# EAGLE design eEvo v1.7_MP8770 (EAGLE 9.6.2)
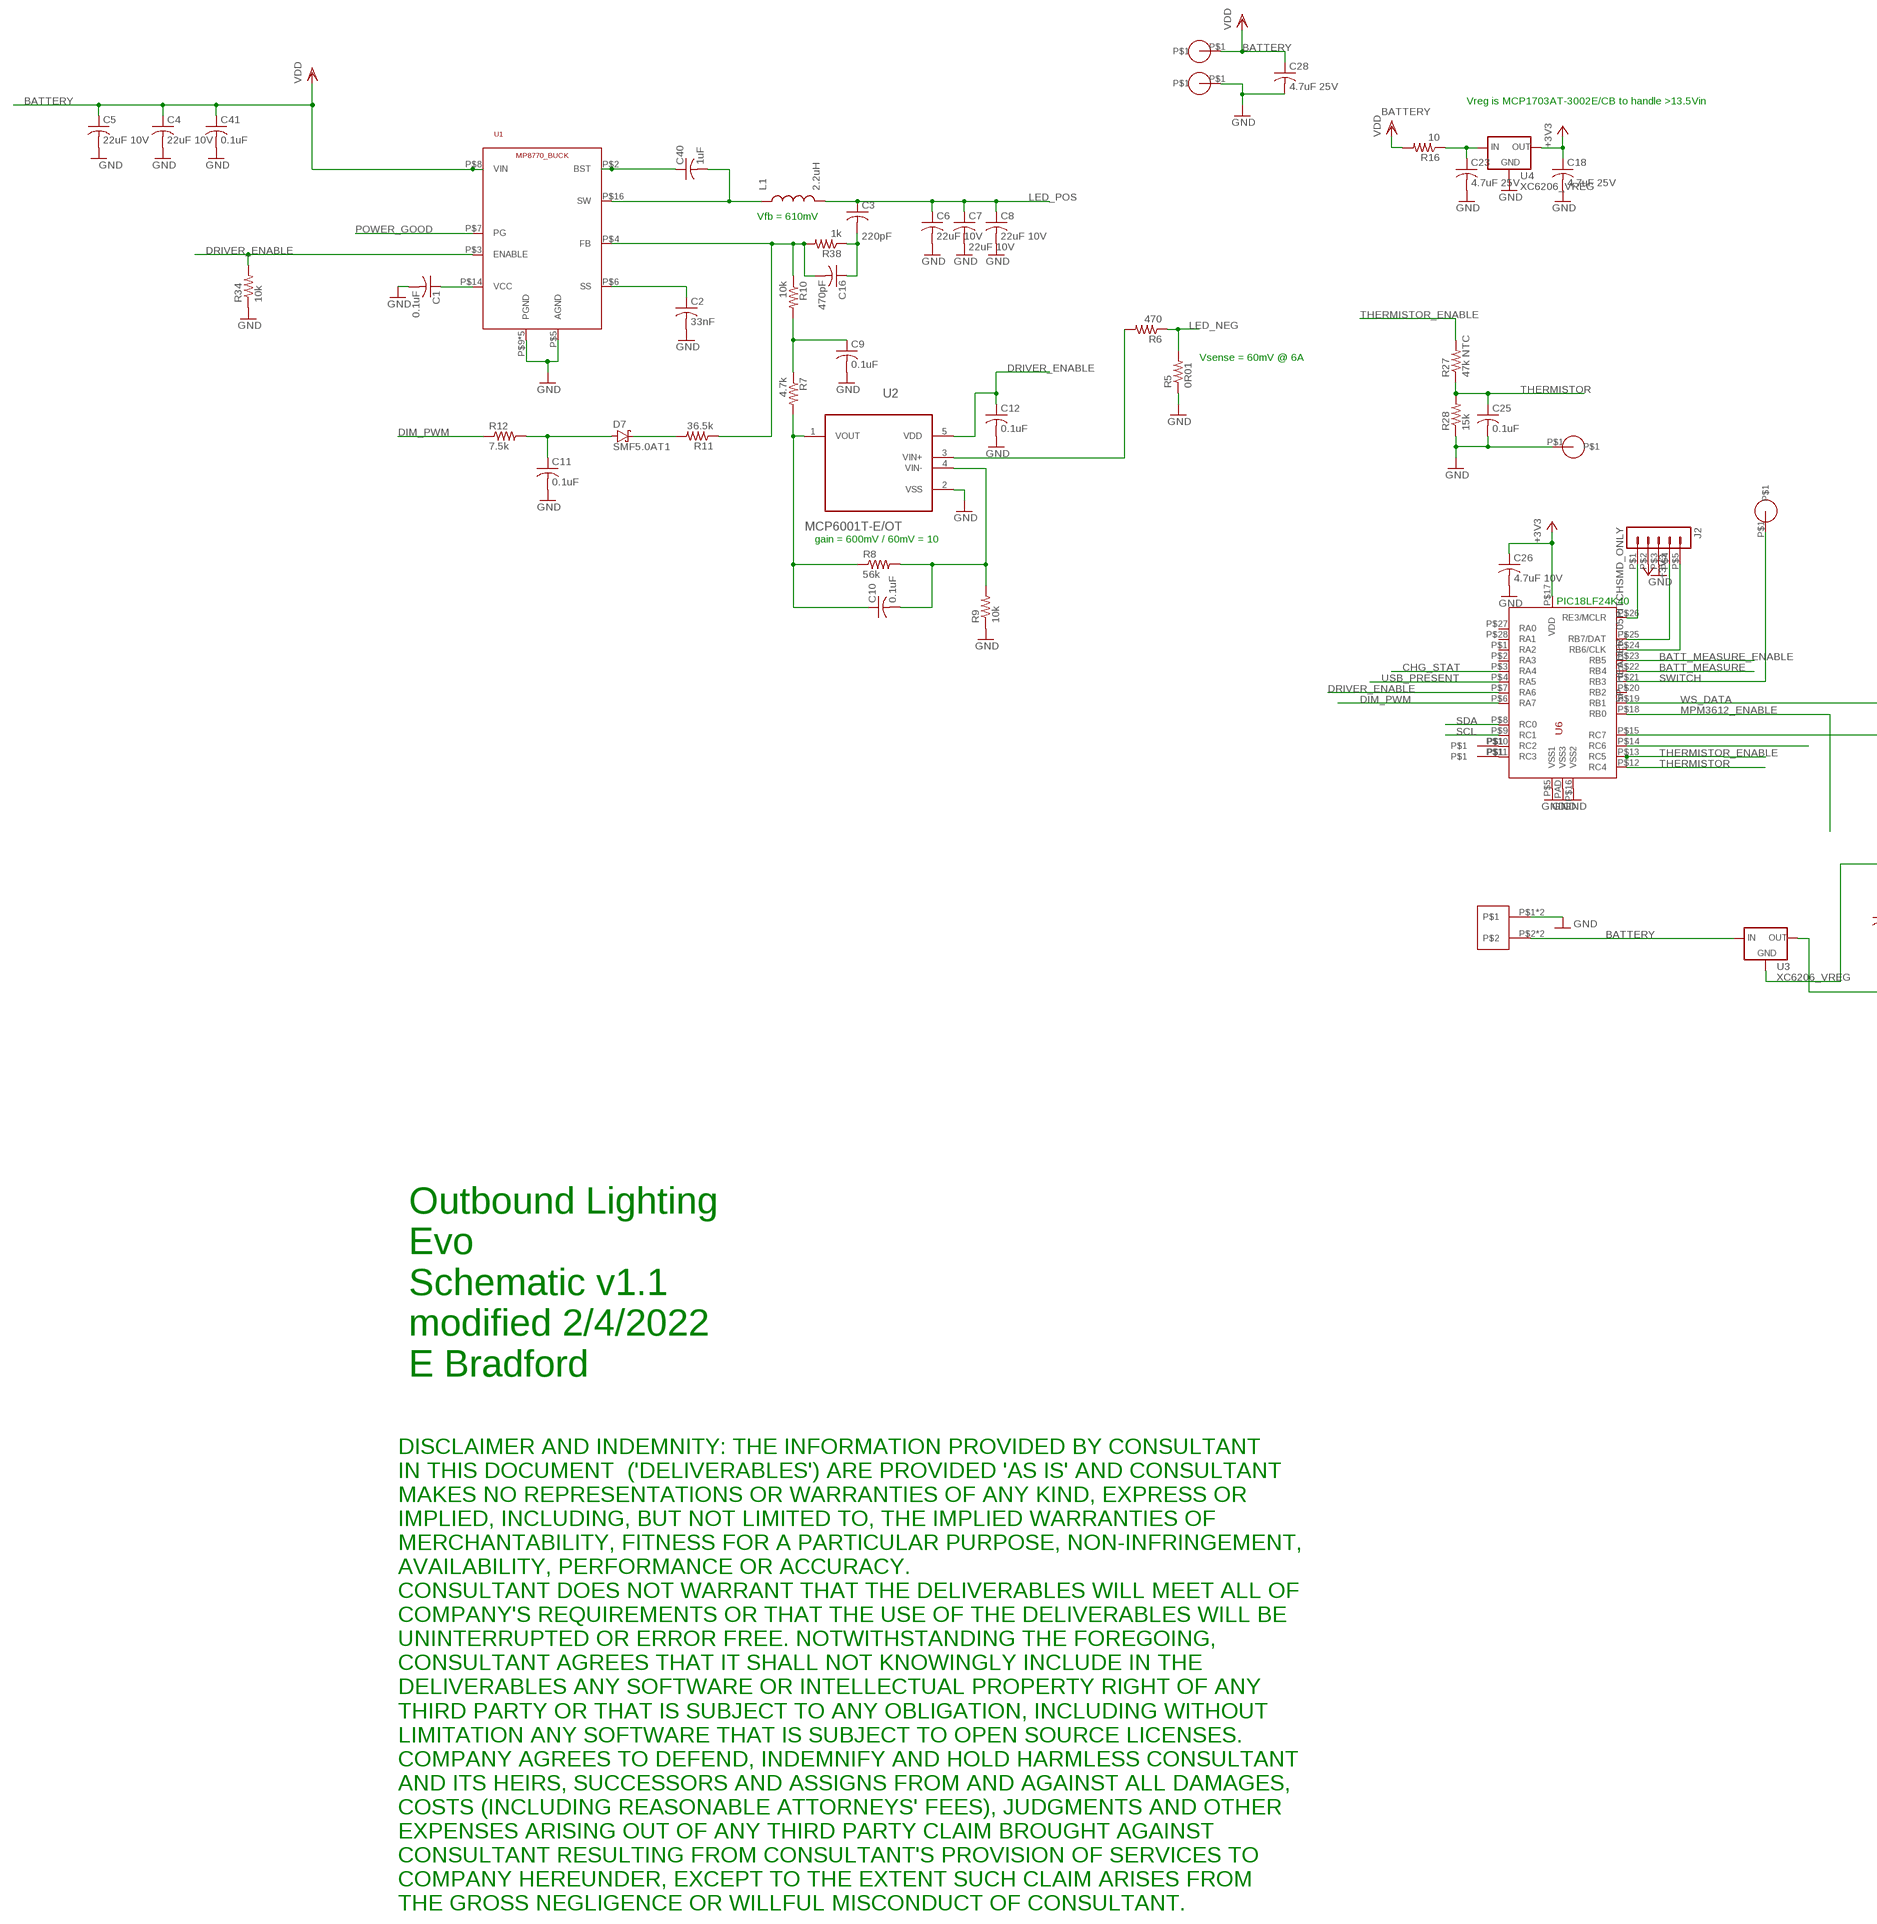
[diagram p0: schematic, sheet 1, part 1 of 2]
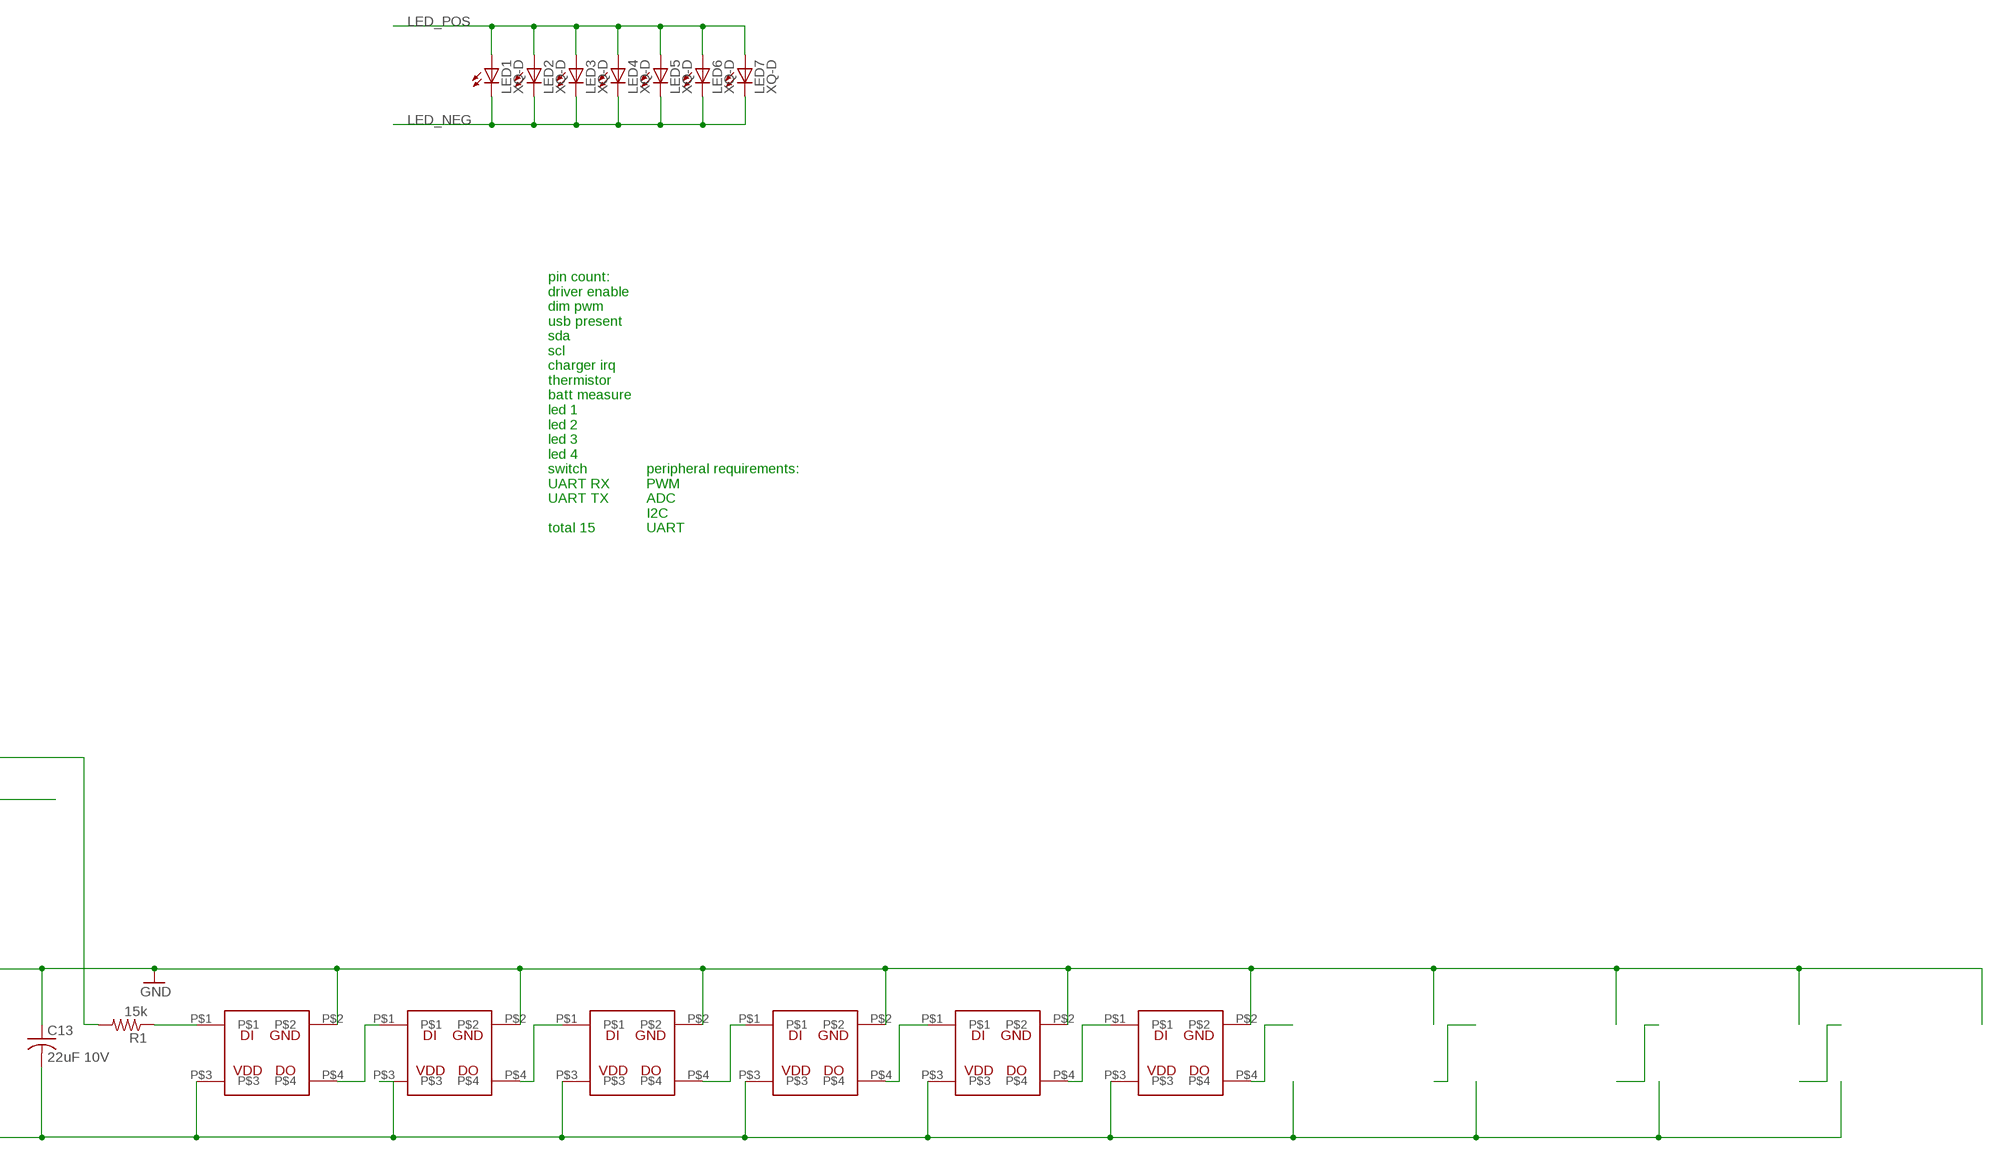
[diagram p1: schematic, sheet 1, part 2 of 2]

## Parts
C1  0.1uF  C-USC0603  [C0603]
C2  33nF  C-USC0603  [C0603]
C3  220pF  C-USC0603  [C0603]
C4  22uF 10V  C-USC0603  [C0603]
C5  22uF 10V  C-USC0603  [C0603]
C6  22uF 10V  C-USC0603  [C0603]
C7  22uF 10V  C-USC0603  [C0603]
C8  22uF 10V  C-USC0603  [C0603]
C9  0.1uF  C-USC0603  [C0603]
C10  0.1uF  C-USC0603  [C0603]
C11  0.1uF  C-USC0603  [C0603]
C12  0.1uF  C-USC0603  [C0603]
C13  22uF 10V  C-USC0603  [C0603]
C16  470pF  C-USC0603  [C0603]
C18  4.7uF 25V  C-USC0603  [C0603]
C23  4.7uF 25V  C-USC0603  [C0603]
C25  0.1uF  C-USC0603  [C0603]
C26  4.7uF 10V  C-USC0603  [C0603]
C28  4.7uF 25V  C-USC0603  [C0603]
C40  1uF  C-USC0603  [C0603]
C41  0.1uF  C-USC0603  [C0603]
D7  SMF5.0AT1  [SOD123FL]
J1  CONN_2-PIN_MOLEX_PICOEZMATE  [CONN_2-PIN_MOLEX_PICOEZMATE]
J2  5P_HEADER_.05PITCHSMD_ONLY  [5P_ICSP_SMD]
L1  2.2uH  SMD_INDUCT_5.7X5.2  [INDUCTOR_5.7X5.2]
LED1  XQ-D  [XQ-D]
LED2  XQ-D  [XQ-D]
LED3  XQ-D  [XQ-D]
LED4  XQ-D  [XQ-D]
LED5  XQ-D  [XQ-D]
LED6  XQ-D  [XQ-D]
LED7  XQ-D  [XQ-D]
R1  15k  R-US_R0603  [R0603]
R5  0R01  R-US_M1206  [M1206]
R6  470  R-US_R0603  [R0603]
R7  4.7k  R-US_R0603  [R0603]
R8  56k  R-US_R0603  [R0603]
R9  10k  R-US_R0603  [R0603]
R10  10k  R-US_R0603  [R0603]
R11  36.5k  R-US_R0603  [R0603]
R12  7.5k  R-US_R0603  [R0603]
R16  10  R-US_R0603  [R0603]
R27  47k NTC  R-US_R0603  [R0603]
R28  15k  R-US_R0603  [R0603]
R34  10k  R-US_R0603  [R0603]
R38  1k  R-US_R0603  [R0603]
RX  WIREPAD_50MIL  [WIREPAD_50MIL]
TX  WIREPAD_50MIL  [WIREPAD_50MIL]
U1  MP8770_BUCK  [MP8770_BUCK]
U2  MCP6001T-E/OT  [SOT95P270X145-5N]
U3  XC6206_VREG  [SOT-23]
U4  XC6206_VREG  [SOT-23]
U6  PIC18F25K40UQFN_4X4  PIC18F26K40UQFN_4X4  [UQFN-28_4X4]
U$2  WS2812B-2020  [WS2812B-2020]
U$3  WS2812B-2020  [WS2812B-2020]
U$4  WS2812B-2020  [WS2812B-2020]
U$5  WS2812B-2020  [WS2812B-2020]
U$6  WS2812B-2020  [WS2812B-2020]
U$7  WS2812B-2020  [WS2812B-2020]
U$12  WIREPAD2X2MM_SQ  [PAD_2X2]
U$13  WIREPAD2X2MM_SQ  [PAD_2X2]
U$14  WIREPAD2X2MM_SQ  [PAD_2X2]
U$15  WIREPAD2X2MM_SQ  [PAD_2X2]

## Nets
+3V3: C18.1 C26.1 J2.P$2 U4.2(OUT) U6.P$17(VDD)
BATT_MEASURE: U6.P$22(RB4)
BATT_MEASURE_ENABLE: U6.P$23(RB5)
BATTERY: C4.1 C5.1 C28.1 C41.1 J1.P$2 J1.P$3 R16.2 U1.P$8(VIN) U3.3(IN) U$14.P$1 ; supply symbol labelled VDD
CHG_STAT: U6.P$3(RA4)
DIM_PWM: R12.1 U6.P$6(RA7)
DRIVER_ENABLE: C12.1 R34.2 U1.P$3(ENABLE) U2.5(VDD) U6.P$7(RA6)
GND: C1.2 C2.2 C4.2 C5.2 C6.2 C7.2 C8.2 C9.2 C11.2 C12.2 C13.1 C18.2 C23.2 C25.2 C26.2 C28.2 C41.2 J1.P$1 J1.P$4 J2.P$3 R5.1 R9.1 R28.1 R34.1 U1.P$5(AGND) U1.P$9(PGND) U1.P$10(PGND) U1.P$11(PGND) U1.P$12(PGND) U1.P$13(PGND) U2.2(VSS) U3.1(GND) U4.1(GND) U6.P$5(VSS1) U6.P$16(VSS2) U6.PAD(VSS3) U$2.P$2 U$3.P$2 U$4.P$2 U$5.P$2 U$6.P$2 U$7.P$2 U$13.P$1 U$15.P$1
LED_NEG: LED1.2(C) LED2.2(C) LED3.2(C) LED4.2(C) LED5.2(C) LED6.2(C) LED7.2(C) R5.2 R6.1
LED_POS: C3.1 C6.1 C7.1 C8.1 L1.P$2 LED1.1(A) LED2.1(A) LED3.1(A) LED4.1(A) LED5.1(A) LED6.1(A) LED7.1(A)
MPM3612_ENABLE: U6.P$18(RB0)
N$1: C3.2 C16.1 R38.1
N$2: C40.2 L1.P$1 U1.P$16(SW)
N$3: C13.2 U3.2(OUT) U$2.P$3 U$3.P$3 U$4.P$3 U$5.P$3 U$6.P$3 U$7.P$3
N$4: C1.1 U1.P$14(VCC)
N$5: C2.1 U1.P$6(SS)
N$6: R1.1 U$2.P$1
N$10: C16.2 R10.1 R11.1 R38.2 U1.P$4(FB)
N$11: R6.2 U2.3(VIN+)
N$12: C10.1 R7.2 R8.1 U2.1(VOUT)
N$13: C9.1 R7.1 R10.2
N$14: C10.2 R8.2 R9.2 U2.4(VIN-)
N$16: C11.1 D7.A R12.2
N$17: U$2.P$4 U$3.P$1
N$18: U$3.P$4 U$4.P$1
N$19: U$4.P$4 U$5.P$1
N$23: RX.P$1 U6.P$11(RC3)
N$24: U$5.P$4 U$6.P$1
N$25: U$6.P$4 U$7.P$1
N$26: U$7.P$4
N$28: TX.P$1 U6.P$10(RC2)
N$29: U6.P$15(RC7)
N$30: C23.1 R16.1 U4.3(IN)
N$31: J2.P$1 U6.P$26(RE3/MCLR)
N$34: D7.C R11.2
N$35: J2.P$4 U6.P$25(RB7/DAT)
N$36: J2.P$5 U6.P$24(RB6/CLK)
N$49: C40.1 U1.P$2(BST)
N$52: U6.P$14(RC6)
POWER_GOOD: U1.P$7(PG)
SCL: U6.P$9(RC1)
SDA: U6.P$8(RC0)
SWITCH: U6.P$21(RB3) U$12.P$1
THERMISTOR: C25.1 R27.1 R28.2 U6.P$12(RC4)
THERMISTOR_ENABLE: R27.2 U6.P$13(RC5)
USB_PRESENT: U6.P$4(RA5)
WS_DATA: R1.2 U6.P$19(RB1)
Unconnected: U6.P$1(RA2) U6.P$2(RA3) U6.P$20(RB2) U6.P$27(RA0) U6.P$28(RA1)

## Notes on the sheet
- Vreg is MCP1703AT-3002E/CB to handle >13.5Vin
- Vfb = 610mV
- Vsense = 60mV @ 6A
- pin count:
  driver enable
  dim pwm
  usb present
  sda
  scl
  charger irq
  thermistor
  batt measure
  led 1
  led 2
  led 3
  led 4
  switch
  UART RX
  UART TX
  
  total 15
- peripheral requirements:
  PWM
  ADC
  I2C
  UART
- gain = 600mV / 60mV = 10
- PIC18LF24K40
- Outbound Lighting
  Evo
  Schematic v1.1
  modified 2/4/2022
  E Bradford
- DISCLAIMER AND INDEMNITY: THE INFORMATION PROVIDED BY CONSULTANT 
  IN THIS DOCUMENT  ('DELIVERABLES') ARE PROVIDED 'AS IS' AND CONSULTANT 
  MAKES NO REPRESENTATIONS OR WARRANTIES OF ANY KIND, EXPRESS OR 
  IMPLIED, INCLUDING, BUT NOT LIMITED TO, THE IMPLIED WARRANTIES OF 
  MERCHANTABILITY, FITNESS FOR A PARTICULAR PURPOSE, NON-INFRINGEMENT, 
  AVAILABILITY, PERFORMANCE OR ACCURACY.
  CONSULTANT DOES NOT WARRANT THAT THE DELIVERABLES WILL MEET ALL OF 
  COMPANY'S REQUIREMENTS OR THAT THE USE OF THE DELIVERABLES WILL BE 
  UNINTERRUPTED OR ERROR FREE. NOTWITHSTANDING THE FOREGOING, 
  CONSULTANT AGREES THAT IT SHALL NOT KNOWINGLY INCLUDE IN THE 
  DELIVERABLES ANY SOFTWARE OR INTELLECTUAL PROPERTY RIGHT OF ANY 
  THIRD PARTY OR THAT IS SUBJECT TO ANY OBLIGATION, INCLUDING WITHOUT 
  LIMITATION ANY SOFTWARE THAT IS SUBJECT TO OPEN SOURCE LICENSES.
  COMPANY AGREES TO DEFEND, INDEMNIFY AND HOLD HARMLESS CONSULTANT 
  AND ITS HEIRS, SUCCESSORS AND ASSIGNS FROM AND AGAINST ALL DAMAGES, 
  COSTS (INCLUDING REASONABLE ATTORNEYS' FEES), JUDGMENTS AND OTHER 
  EXPENSES ARISING OUT OF ANY THIRD PARTY CLAIM BROUGHT AGAINST 
  CONSULTANT RESULTING FROM CONSULTANT'S PROVISION OF SERVICES TO 
  COMPANY HEREUNDER, EXCEPT TO THE EXTENT SUCH CLAIM ARISES FROM 
  THE GROSS NEGLIGENCE OR WILLFUL MISCONDUCT OF CONSULTANT.

## Library data of the parts
C1-C13 C16 C18 C23 C25 C26 C28 C40 C41 = resistor:C-US: CAPACITOR, American symbol
D7 = diode:SMF5.0AT1: 200 W Transient Voltage Suppressor Source: Data sheet <http://www.onsemi.com/pub_link/Collateral/SMF5.0AT1-D.PDF>
J1 = Everett (4):CONN_2-PIN_MOLEX_PICOEZMATE
J2 = Everett (4):5P_HEADER_.05PITCH
L1 = Everett (4):SMD_INDUCT_5.7X5.2
LED1-LED7 = Everett (5):XQ-D
R1 R5-R12 R16 R27 R28 R34 R38 = resistor:R-US_: RESISTOR, American symbol
RX TX = Everett (4):WIREPAD_50MIL
U1 = Everett (4):MP8770_BUCK
U2 = Microchip_By_element14_Batch_1:MCP6001T-E/OT: 1 MHz, Low-Power Op Amp; MPN: MCP6001T-E/OT; OC_FARNELL: 1332116; OC_NEWARK: 34M7471; PACKAGE: SOT23-5; SUPPLIER: Microchip
U3 U4 = Everett (4):XC6206_VREG
U6 = Everett (4):PIC18F26K40
U$2-U$7 = Everett (4):WS2812B-2020: WS2812 4-pin 2020 package
U$12-U$15 = Everett (4):WIREPAD

## Board
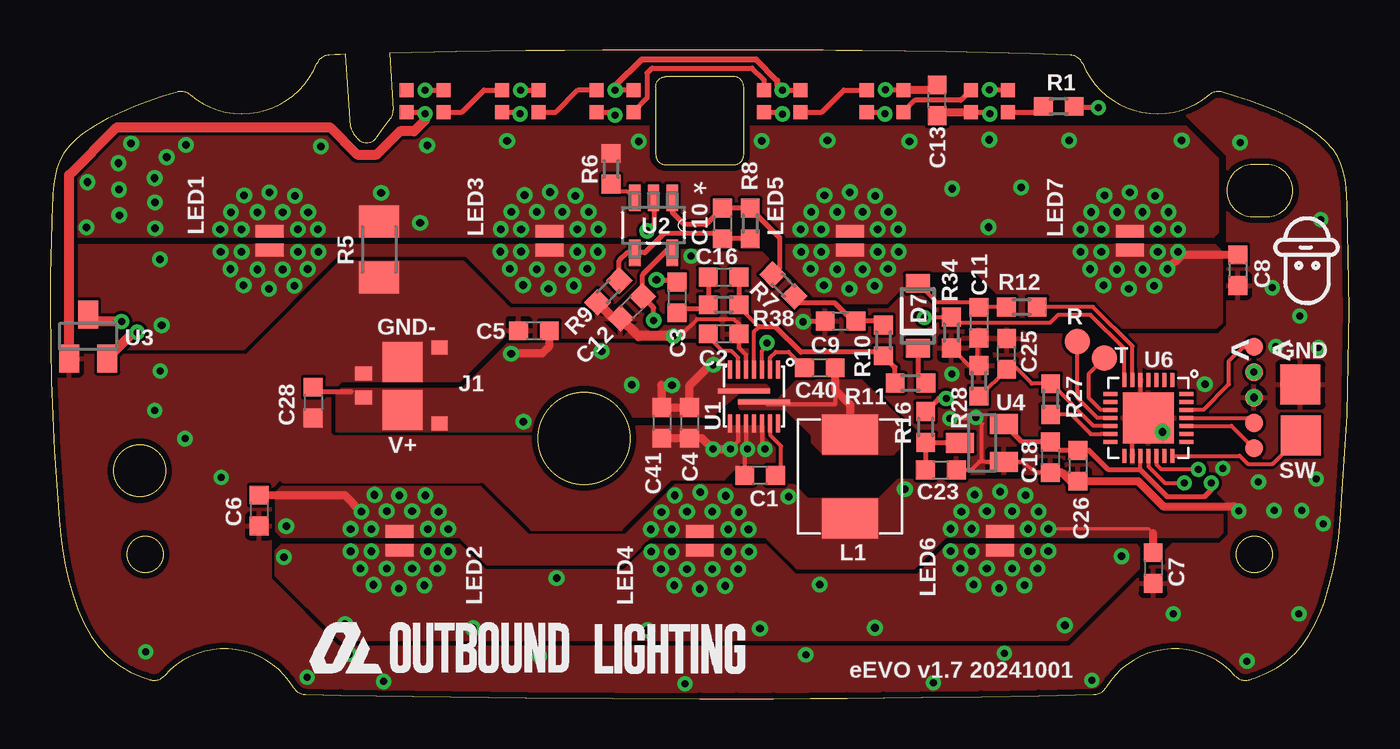
[diagram p2: board, top side]
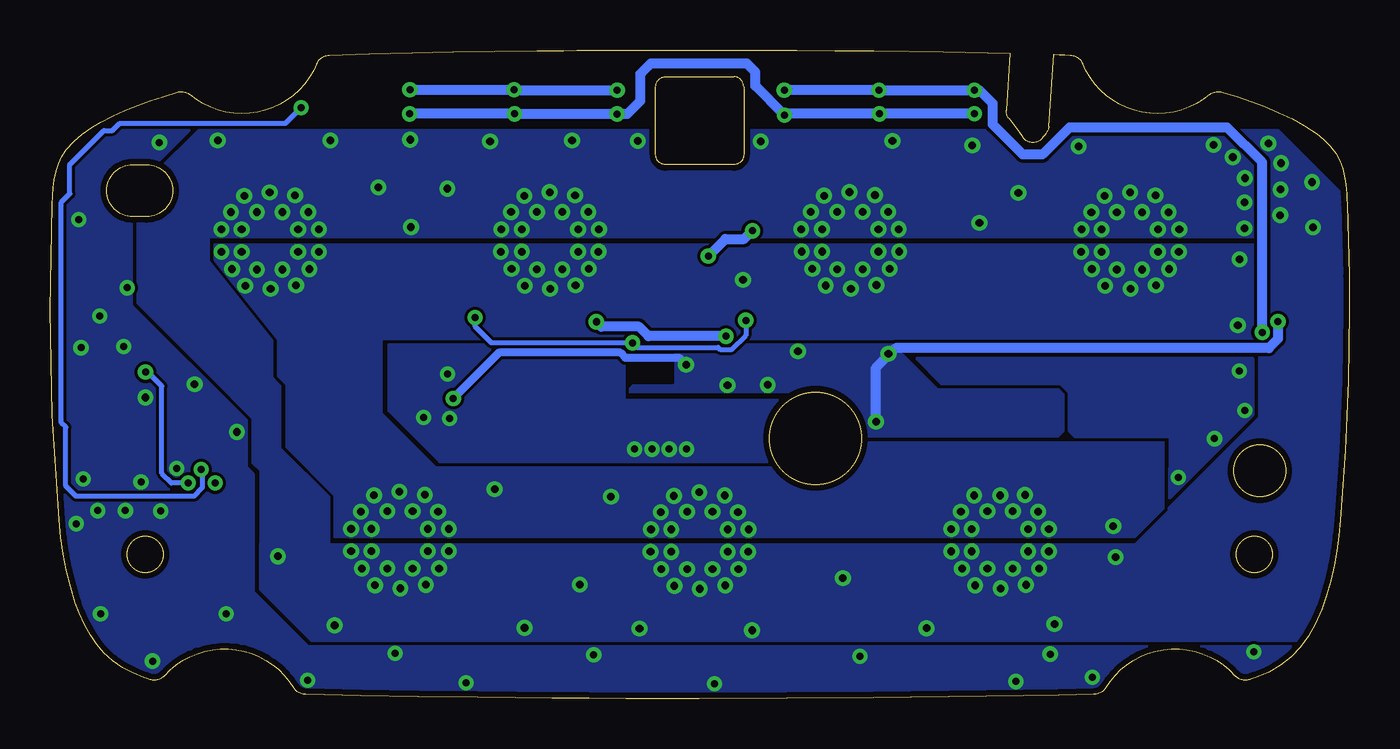
[diagram p3: board, bottom side, seen from below]

Size 64.96 x 32.43 mm. Coordinates in mm from the lower left corner, seen from the top.
Outline: 60.83,24.1 arc180 60.83,26.7 60.13,26.7 arc180 60.13,24.1 60.83,24.1
Outline: 14.77,32.22 arc1 13.94,32.18 arc64 13.34,31.75 arc-107 7,30.19 arc56 6.35,30.33 5.59,30.09 4.89,29.85 4.25,29.62 3.52,29.31 2.85,28.99 2.25,28.66 1.64,28.25 1.3,27.97 0.97,27.65 0.7,27.29 0.49,26.91 0.35,26.51 0.28,26.26 0.23,25.99 0.19,25.74 0.17,25.49 0.15,25.24 0.13,25.01 0.12,24.71 arc3 0,19.37 arc5 0.45,8.93 0.54,8.14 0.64,7.38 0.77,6.66 0.95,5.88 1.16,5.14 1.4,4.46 1.72,3.73 2.07,3.11 2.46,2.57 2.91,2.09 3.45,1.66 4.04,1.33 4.71,1.05 arc1 4.99,0.96 arc66 5.73,1.15 arc-107 12.19,0.55 arc58 12.77,0.21 14.52,0.17 16.31,0.14 18.14,0.11 20.01,0.08 21.93,0.06 23.8,0.04 28.13,0.01 32.48,0 34.33,0 36.17,0.01 38.01,0.02 39.85,0.03 41.68,0.05 43.58,0.07 46.55,0.11 49.42,0.15 52.19,0.21 arc58 52.77,0.55 arc-107 59.23,1.15 arc66 59.97,0.96 arc1 60.25,1.05 60.82,1.28 61.33,1.55 61.82,1.9 62.26,2.3 62.61,2.71 62.93,3.18 63.22,3.7 63.49,4.29 63.68,4.8 63.93,5.58 64.14,6.44 64.29,7.24 64.41,8.06 64.5,8.93 arc8 64.84,24.71 64.81,25.15 64.78,25.55 64.73,25.95 64.65,26.38 64.53,26.76 64.37,27.11 64.15,27.44 63.75,27.88 63.34,28.23 62.85,28.57 62.41,28.83 61.84,29.12 61.19,29.42 60.55,29.67 59.95,29.89 59.3,30.11 58.6,30.33 arc57 57.95,30.19 arc-107 51.62,31.75 arc64 51.01,32.18 49.02,32.26 46.87,32.3 44.81,32.34 42.73,32.37 40.61,32.39 39.95,32.4 39.29,32.41 38.64,32.41 38,32.42 37.36,32.42 36.84,32.42 36.34,32.43 35.55,32.43 34.65,32.43 33.62,32.43 32.48,32.44 31.59,32.43 30.78,32.43 30.06,32.43 29.43,32.43 28.88,32.43 28.31,32.42 27.62,32.42 25.71,32.41 23.76,32.39 20.31,32.34 16.97,32.28 17.15,29.42 arc-44 17.01,28.99 arc7 16.33,28.07 arc-109 15.36,28.03 arc2 15.17,28.26 arc-36 15.03,28.61 14.77,32.22
Outline: 30.28,30.6 30.28,27.2 arc90 30.78,26.7 34.18,26.7 arc90 34.68,27.2 34.68,30.6 arc90 34.18,31.1 30.78,31.1 arc90 30.28,30.6
Outline: circle at 60.2,7.21 radius 0.9
Outline: circle at 26.69,13.02 radius 2.3
Outline: circle at 4.76,7.21 radius 0.9
Outline: circle at 4.48,11.4 radius 1.3
Copper layers (1*16): Top 0.035mm / dielectric 0.73mm / Bottom 0.035mm
Design rules "default *": minimum track width 6mil, minimum drill 0.35mm, track to track 6mil, track to pad 6mil, pad to pad 6mil, via to via 6mil, smd to smd 6mil, copper to edge 12mil, drill to drill 6mil, minimum pad ring 10mil, minimum via ring 8mil, stop-mask expansion 4mil, vias tented up to drill 15mil, thermal gap 10mil

### Footprints (pad centres in the part's own frame; a part is rotated, then mirrored left to right if it is on the bottom)
C0603 = smd 0.94 x 0.94: 1 -0.77,0; 2 0.77,0
SOD123FL = smd 0.91 x 1.22: A 1.625,0; C -1.625,0
CONN_2-PIN_MOLEX_PICOEZMATE = smd 0.701 x 0.851: P$1 0.6,4.605; P$2 -0.6,4.605 | smd 0.701 x 0.8: P$3 -1.9,0.795; P$4 1.9,0.795
5P_ICSP_SMD = smd 0.889 x 0.889: P$1 0,0; P$2 1.27,0; P$3 2.54,0; P$4 3.81,0; P$5 5.08,0
INDUCTOR_5.7X5.2 = smd 2 x 2.8: P$1 -2.1,0; P$2 2.1,0
XQ-D = smd 0.635 x 1.397: 1 -0.469,0; 2 0.469,0
R0603 = smd 0.94 x 0.94: 1 -0.77,0; 2 0.77,0
M1206 = smd 1.6 x 2: 1 -1.4,0; 2 1.4,0
WIREPAD_50MIL = smd 1.27 x 1.27: P$1 0,0
MP8770_BUCK = smd 0.9 x 0.2: P$1 -1.35,1.2; P$2 -1.35,0.8; P$3 -1.35,0.4; P$4 -1.35,0; P$5 -1.35,-0.4; P$6 -1.35,-0.8; P$7 -1.35,-1.2; P$9 1.35,-1.2; P$10 1.35,-0.8; P$11 1.35,-0.4; P$12 1.35,0; P$13 1.35,0.4; P$14 1.35,0.8; P$15 1.35,1.2 | smd 0.25 x 2.6: P$8 -0.275,-0.5; P$16 0.275,0.5
SOT95P270X145-5N = smd 1.321 x 0.559: 1 -1.372,0.94; 2 -1.372,0; 3 -1.372,-0.94; 4 1.372,-0.94; 5 1.372,0.94
SOT-23 = smd 1 x 1.4: 1 -0.95,-1.1; 2 0.95,-1.1; 3 0,1.1
UQFN-28_4X4 = smd 0.7 x 0.2: P$1 -1.9,1.2; P$2 -1.9,0.8; P$3 -1.9,0.4; P$4 -1.9,0; P$5 -1.9,-0.4; P$6 -1.9,-0.8; P$7 -1.9,-1.2; P$15 1.9,-1.2; P$16 1.9,-0.8; P$17 1.9,-0.4; P$18 1.9,0; P$19 1.9,0.4; P$20 1.9,0.8; P$21 1.9,1.2 | smd 0.2 x 0.7: P$8 -1.2,-1.9; P$9 -0.8,-1.9; P$10 -0.4,-1.9; P$11 0,-1.9; P$12 0.4,-1.9; P$13 0.8,-1.9; P$14 1.2,-1.9; P$22 1.2,1.9; P$23 0.8,1.9; P$24 0.4,1.9; P$25 0,1.9; P$26 -0.4,1.9; P$27 -0.8,1.9; P$28 -1.2,1.9 | smd 2.55 x 2.55: PAD 0,0
WS2812B-2020 = smd 0.7 x 0.7: P$1 -0.915,0.55; P$2 0.915,0.55; P$3 -0.915,-0.55; P$4 0.915,-0.55
PAD_2X2 = smd 2 x 2: P$1 0,0

### Placement (x,y rotation side)
C1  35.5,11.17 180 top
C2  33.67,18.24 0 top
C3  31.34,20.06 270 top
C4  31.96,13.79 270 top
C5  24.19,18.4 180 top
C6  10.46,9.41 270 top
C7  55.14,6.53 270 top
C8  59.37,21.42 270 top
C9  39.51,18.88 180 top
C10  33.62,23.76 270 top
C11  46.43,18.8 270 top
C12  29.07,19.56 225 top
C13  44.35,29.91 90 top
C16  33.68,21.08 0 top
C18  50.01,12.07 270 top
C23  44.53,11.44 0 top
C25  47.82,17.24 90 top
C26  51.38,11.65 270 top
C28  13.16,14.8 270 top
C40  38.48,16.55 0 top
C41  30.58,13.8 270 top
D7  43.38,19.14 90 top
J1  20.27,15.66 90 top
J2  60.18,17.6 270 top
L1  39.99,11.12 270 top
LED1  10.98,22.9 90 top
LED2  17.48,7.9 270 top
LED3  24.98,22.9 90 top
LED4  32.48,7.9 270 top
LED5  39.98,22.9 90 top
LED6  47.48,7.9 270 top
LED7  53.98,22.9 90 top
R1  50.42,29.62 0 top
R5  16.45,22.46 90 top
R6  28.05,26.49 270 top
R7  36.66,20.66 135 top
R8  35,23.76 270 top
R9  27.91,20.36 45 top
R10  41.66,17.92 90 top
R11  43.02,15.78 0 top
R12  48.57,19.59 180 top
R16  43.77,13.59 90 top
R27  50.02,14.98 270 top
R28  46.43,15.89 270 top
R34  45.06,18.31 90 top
R38  33.67,19.7 0 top
RX  51.36,17.87 180 top
TX  52.71,17.04 180 top
U1  35.2,15.12 270 top
U2  30.17,23.67 270 top
U3  1.91,18.11 0 top
U4  46.59,12.79 90 top
U6  54.9,14.05 270 top
U$2  46.96,29.89 180 top
U$3  41.74,29.89 180 top
U$4  36.6,29.89 180 top
U$5  28.24,29.89 180 top
U$6  23.5,29.89 180 top
U$7  18.75,29.89 180 top
U$12  62.53,13.15 0 top
U$13  62.5,15.7 0 top
U$14  17.62,14.44 0 top
U$15  17.62,16.83 0 top

### Tracks (layer width: path | path; a pad name or v marks a point on that pad's centre or on a via)
+3V3  (via drill 0.35)  (1 unrouted)
  Top 0.2: 54.47,11.46 54.47,11.47 54.5,11.5
  Top 0.203: 54.5,11.5 U6.P$17
  Top 0.254: 54.47,11.46 52.88,11.46 51.93,12.42 C26.1 50.43,12.42 C18.1 48.59,12.84 U4.2 | v58.05,10.78 58.05,10.44 57.71,10.1 55.85,10.1 54.47,11.47
  Bottom 0.254: v58.05,10.78 58.88,10.78 59.37,11.27 59.37,15.62 60.07,16.33 J2.P$2
  other vias: 60.18,16.33
BATTERY  (via drill 0.35, 0.38)
  Top 0.254: v44.8,15.02 44.43,15.02 R16.2 | 15.07,15.34 13.39,15.34 C28.1
  Top 0.406: v23.05,17.25 23.08,17.28 24.6,17.28 24.96,17.63 C5.1 | v33.16,16.7 33.01,16.7 31.96,15.65 C4.1 C41.1 30.58,15.66 30.55,15.69
  Top 0.508: U3.3 2.27,18.85 v3.57,18.85
  Bottom 0.406: v33.16,16.7 33.51,17.05 36.2,17.05 36.45,17.3 42.52,17.3 v44.8,15.02
  Bottom 0.508: v3.57,18.85 3.57,17.99 4.03,17.53 22.69,17.53 23.66,16.55 v23.66,13.84
  other vias: 31.09,15.67 27.57,17.37 29.09,15.69
  pour Top (no thermals): 35.98,15.28 35.98,15.54 35.82,15.71 33.82,15.71 33.71,15.81 33.71,17.46 33.41,17.76 22.85,17.76 20.6,15.51 14.56,15.51 14.28,15.22 14.28,13.36 24.56,13.36 25.3,14.09 33.06,14.09 34.54,15.34 34.57,15.28
  pour Bottom: 35.99,15.28 35.99,15.53 35.82,15.71 33.79,15.71 33.72,15.78 33.72,17.46 33.42,17.76 22.85,17.76 20.6,15.5 14.56,15.5 14.28,15.22 14.28,13.36 14.57,13.07 24.26,13.07 26.52,15.28
DIM_PWM
  Top 0.203: U6.P$6 54.1,17.62 52.13,19.59 R12.1
DRIVER_ENABLE  (via drill 0.35)
  Top 0.203: U6.P$7 53.7,17.5 52.01,19.19 50.39,19.19 49.99,18.79 45.34,18.79 R34.2 43.71,19.08 | v35.83,17.79 35.83,17.64 35.6,17.4 U1.P$3
  Top 0.254: v43.71,19.06 43.71,19.08 | v30.18,18.92 30.18,19.55 C12.1 29.62,21.2 30.94,22.53 30.94,22.47 U2.5
  Bottom 0.254: v30.18,18.92 30.18,18.17 30.88,17.46 31.45,17.46 31.56,17.57 35.61,17.57 v35.83,17.79 42.89,17.79 43.71,18.61 v43.71,19.06
GND  (via drill 0.35, 0.38)
  Top 0.203: U6.P$16 54.1,13.25 54.52,13.66 | 54.52,13.66 U6.PAD | U6.P$5 54.5,13.68 54.52,13.66 | C18.2 49.27,11.3 48.58,11.85 U4.1 | U4.1 46.45,11.84 46.05,11.44 C23.2 | U4.1 46.59,11.84 46.59,13.75 v46.28,14.06 | U1.P$13 35.6,12.61 v35.73,12.48 | U1.P$11 34.8,12.55 v34.87,12.48 34.73,12.34 C1.2 | U1.P$10 34.4,12.87 v34,12.48 | U1.P$5 34.8,17.2 34.44,17.56 C2.2 34.44,18.73 34.2,18.97 32.33,18.97 31.48,18.12 v31.17,18.12 | C11.2 46.36,18.03 46.36,16.74 R28.1 45.93,16.66 R34.1
  Top 0.254: v44.98,14.01 45.03,14.06 v46.28,14.06 | v29.85,23.4 30.18,23.73 30.18,25.03 U2.2 | v37.65,18.85 37.68,18.88 C9.2 | U$2.P$2 46.88,29.34 v46.97,29.24 | U$3.P$2 41.63,29.34 v41.73,29.24 | U$4.P$2 36.52,29.34 v36.62,29.24 | U$5.P$2 28.09,29.34 v28.24,29.18 | U$6.P$2 23.4,29.34 v23.49,29.24 | U$7.P$2 18.65,29.34 v18.75,29.24
  Top 0.4: C26.2 50.99,10.88 50.57,11.3 C18.2
  Top 0.406: C41.2 C4.2 32.59,13.02 v33.14,12.48 v34,12.48 | C13.1 44.54,29.34 U$2.P$2 | C26.2 54.38,10.88 55.65,9.61 59.19,9.61 v59.43,9.38
  Top 0.508: U3.1 0.96,26.19 3.34,28.57 13.99,28.57 15.35,27.21 16.34,27.21 17.5,28.37 18.19,28.37 18.75,28.92 v18.75,29.24 | R9.1 28.17,19.02 C12.2 29.43,18.12 v31.17,18.12
  Bottom 0.508: v37.65,18.85 37.4,18.6 35.52,18.6 35.04,18.12 v31.17,18.12 | v18.75,29.24 v23.49,29.24 28.18,29.24 v28.24,29.18 29.7,30.65 29.7,31.33 30.13,31.76 34.93,31.76 35.46,31.23 35.46,29.88 36.11,29.24 v36.62,29.24 v41.72,29.24 v41.73,29.24 v46.97,29.24 | v32.05,22.13 31.2,22.98 30.27,22.98 v29.85,23.4
  other vias: 55.61,13.34 60.18,15.06 44.15,0.79 52.08,0.92 47.71,2.26 59.83,1.88 56.15,4.24 63.64,8.75 63.41,17.55 57.73,15.72 37.77,2.2 31.74,0.75 24.48,2.12 16.67,0.86 14.96,2.23 4.79,2.34 12.85,1.07 8.55,11.05 6.75,13 5.23,14.42 5.5,16.38 61.09,20.55 63.51,23.96 59.49,27.81 62.43,4.23 61.18,9.4 62.56,9.4 63.29,10.98 60.41,10.83 58.61,11.51 61.27,17.61 62.48,19.13 45.08,16.23
  pour Top (no thermals): 20.48,15.89 22.73,18.14 22.73,19.78 20.68,21.83 14.47,21.83 9.74,17.1 9.74,12.72 11.6,10.87 21.66,10.87 24.06,8.46 28.55,8.46 31.06,10.98 33.7,10.98 34.53,11.8 36.3,11.8 36.3,12.99 35.69,13.6 25.22,13.6 24.72,13.1 14.17,13.1 14,13.27 14,15.32 14.59,15.91
  pour Top: 11.61,11.08 11,10.46 11,6.01 14.41,2.6 50.99,2.6 56.11,7.73 58.46,7.73 58.94,8.21 58.94,9.71 55.55,13.1 55.55,15.37 58.86,18.68 58.86,27.12 56.48,29.5 56.48,30.42 56.71,30.66 61.87,30.66 65.65,26.88 65.65,1.15 64.23,-0.27 4.55,-0.27 -0.14,4.42 -0.14,15.68 1.36,17.18 10.92,17.18 11.65,16.45
  pour Top: 33.53,18.07 22.73,18.04 22.73,19.76 22.99,19.5 28.44,19.5 31.38,22.44 35.45,22.44 38.44,19.45 41.91,19.45 43.5,21.03 48.94,18.21 58.43,18.21 58.43,15.66 54.02,11.25 45.62,11.25 40.64,16.22 35.38,16.22
  pour Bottom: 48.04,17.69 48.04,14.41 45.49,11.85 28.04,11.85 27.86,12.03 27.86,14.6 28.17,14.92 36.24,14.92 36.24,17.07 36.85,17.69
  pour Bottom: 9,9.99 4.81,14.19 4.81,17 21.65,17 20.41,15.76 14.47,15.76 14.03,15.32 14.03,13.39 13.76,13.12 8.97,13.12
  pour Bottom: 3.97,-0.96 2,1.01 2,2.59 52.03,2.59 54.78,5.34 54.78,11.23 55.13,11.59 55.13,13.93 60.87,19.66 60.87,25.53 57.64,28.75 64.16,28.75 65.26,27.66 65.26,2.07 62.57,-0.61
LED_NEG  (via drill 0.38)
  other vias: 9.57,23.46 10.36,24.33 11.63,24.33 12.39,23.46 23.55,23.47 24.33,24.34 25.6,24.34 26.36,23.47 38.56,23.47 39.34,24.33 40.61,24.33 41.38,23.47 52.55,23.46 53.34,24.33 54.61,24.33 55.37,23.46 18.89,7.37 18.1,6.5 16.83,6.5 16.07,7.37 33.9,7.35 33.11,6.48 31.84,6.48 31.08,7.35 48.89,7.37 48.1,6.51 46.83,6.51 46.07,7.37 22.53,23.47 23.06,24.34 23.72,25.18 24.99,25.33 26.26,25.15 26.92,24.34 27.41,23.47 51.51,23.46 52.05,24.33 52.71,25.17 53.98,25.32 55.25,25.14 55.91,24.33 56.39,23.46 37.52,23.47 38.05,24.33 38.71,25.17 39.98,25.32 41.25,25.15 41.91,24.33 42.39,23.47 8.51,23.46 9.04,24.33 9.7,25.16 10.97,25.32 12.24,25.14 12.9,24.33 13.38,23.46 19.9,7.37 19.37,6.5 18.71,5.67 17.44,5.51 16.17,5.69 15.51,6.5 15.03,7.37 34.94,7.35 34.4,6.48 33.74,5.64 32.47,5.49 31.2,5.67 30.54,6.48 30.06,7.35 49.9,7.37 49.37,6.51 48.71,5.67 47.44,5.52 46.17,5.7 45.51,6.51 45.03,7.37 5.25,23.52 5.24,24.82 5.23,26.03 5.83,27.08 6.79,27.68 4.05,27.76 3.42,26.78 3.45,25.46 3.46,24.17 41.23,3.54 38.47,5.7 35.49,3.5 50.73,3.67 53.57,7.12 29.86,3.42 25.32,6.03 21.14,3.52 14.75,3.73 11.69,7.08 13.54,27.62 18.85,27.66 18.5,23.79 16.55,25.29 22.85,27.89 35.58,27.89 29.43,27.87 42.96,27.87 46.95,27.95 38.86,27.91 50.95,27.91 56.57,27.91 48.54,25.57 45.09,25.5 46.91,23.58 1.82,23.57 1.87,25.83
  pour Top (no thermals): 1.38,23.13 58.17,23.13 58.38,23.34 58.38,26.99 56.79,28.58 3.88,28.58 1.38,26.07
  pour Top (no thermals): 11.58,7.73 20.48,7.73 21.76,6.45 28.7,6.45 29.98,7.74 35.76,7.74 37.27,6.23 43.38,6.23 44.88,7.73 54.29,7.73 54.45,7.58 54.45,6.5 50.84,2.89 14.52,2.89 11.26,6.15 11.26,7.41
  pour Bottom: 56.97,23.07 0.25,23.07 0.25,25.17 3.54,28.46 57.56,28.46 59.68,26.34 59.68,25.26 60.62,24.32 60.62,19.77 56.94,16.09 53.8,16.09 53.8,17.9 56.97,21.87
  pour Bottom: 4.11,23.14 4.57,22.69 4.57,14.05 9.07,9.55 9.07,9.4 10.73,7.74 54.5,7.74 54.5,5.48 51.9,2.88 1.4,2.88 -0.14,4.42 -0.14,23.14
  pour Bottom: 50.96,7.63 50.96,10.09 50.96,10.09 53.39,12.52 53.39,15.64 53.98,16.23 53.98,16.26 56.85,16.26 56.98,16.13 54.87,14.02 54.87,11.78 54.49,11.4 54.49,7.42 51.15,7.42 50.98,7.6
LED_POS  (via drill 0.38)
  Top 0.152: 55.14,8.27 54.92,8.49 v49.9,8.49
  Top 0.254: v30.32,20.94 31.23,20.94 C3.1
  Top 0.406: 40.05,8.96 L1.P$2 | C6.1 14.73,10.18 v15.56,9.35 | C7.1 55.14,8.27 | C8.1 56.57,22.19 v55.86,21.48
  other vias: 9.57,22.34 10.36,21.46 11.63,21.46 12.39,22.34 23.55,22.36 24.33,21.47 25.6,21.47 26.36,22.36 38.56,22.35 39.34,21.46 40.61,21.46 41.38,22.35 52.55,22.35 53.34,21.46 54.61,21.46 55.37,22.35 18.89,8.48 18.1,9.37 16.83,9.37 16.07,8.48 33.9,8.46 33.11,9.35 31.84,9.35 31.08,8.46 48.89,8.49 48.1,9.38 46.83,9.38 46.07,8.49 45.03,8.49 45.56,9.35 46.22,10.19 47.49,10.35 48.76,10.17 49.42,9.35 30.04,8.46 30.57,9.33 31.23,10.16 32.5,10.32 33.77,10.14 34.43,9.33 34.91,8.46 15.03,8.48 16.22,10.19 17.46,10.16 18.76,10.16 19.42,9.35 19.9,8.48 13.41,22.34 12.88,21.48 12.22,20.64 10.95,20.49 9.68,20.67 9.02,21.48 8.53,22.34 56.39,22.35 55.2,20.64 53.93,20.49 52.66,20.67 52,21.48 51.51,22.35 42.42,22.35 41.88,21.49 41.22,20.65 39.95,20.5 38.68,20.68 38.02,21.49 37.54,22.35 27.38,22.36 26.85,21.49 26.19,20.65 24.92,20.5 23.65,20.68 22.99,21.49 22.5,22.36 11.81,8.63 36.92,10.1 42.73,10.47 5.58,18.66 5.5,21.97
  pour Top (no thermals): 41.41,10 37.89,10 37.18,10.71 31.24,10.71 28.75,8.22 23.92,8.22 21.52,10.62 11.55,10.62 11.24,10.31 11.24,8.39 11.56,8.06 20.45,8.06 21.83,6.68 28.66,6.68 30.04,8.06 35.76,8.06 37.33,6.5 43.22,6.5 44.79,8.07 58.4,8.07 58.65,8.32 58.65,9.57 57.26,10.96 42.37,10.96
  pour Top (no thermals): 1.31,22.73 58.21,22.73 58.59,22.36 58.59,18.79 58.29,18.5 49.08,18.5 46.24,21.34 43.41,21.34 41.82,19.74 38.52,19.74 36.26,22 36.26,22.69 31.19,22.69 28.26,19.76 23.13,19.76 20.79,22.1 14.33,22.1 9.68,17.44 3.65,17.44 1.31,19.79
  pour Bottom: 4.76,22.74 56.78,22.74 56.78,21.92 53.61,17.97 4.76,17.97
  pour Bottom: 53.61,18 53.61,16.14 53.19,15.72 53.19,12.58 50.77,10.16 50.77,8.06 10.72,8.06 9.26,9.52 9.26,12.85 24.67,12.85 26.12,11.4 28.2,11.4 28.38,11.58 45.65,11.58 48.33,14.25 48.33,17.97 48.35,18
MPM3612_ENABLE  (via drill 0.35)
  Top 0.19: U6.P$18 54.9,11.61 55.74,10.78 v56.69,10.78
N$1
  Top 0.254: C3.2 31.33,19.27 31.3,19.27 31.5,19.47 32.68,19.47 R38.1 C16.1
N$2
  Top 0.203: C40.2 39.25,14.71 35.83,14.71 U1.P$16
  Top 0.406: C40.2 39.25,15.46 39.99,14.71 L1.P$1
  pour Top (no thermals): 34.41,14.95 34.41,14.56 34.5,14.47 36.73,14.47 38.02,13.18 38.02,12.81 38.6,12.23 38.6,12.21 42.18,12.21 42.48,12.51 42.48,14.02 40.57,15.93 37.3,15.93 36.33,14.95
N$3  (via drill 0.35)
  Top 0.254: v36.6,30.43 v36.61,30.44 U$4.P$3 | v41.75,30.45 U$3.P$3 | v46.97,30.45 U$2.P$3 | U$5.P$3 28.27,30.44 v28.25,30.42 | v23.52,30.42 23.53,30.44 U$6.P$3 | v18.76,30.42 18.77,30.44 U$7.P$3
  Top 0.305: v28.25,30.42 28.25,30.64 29.58,31.97 35.29,31.97 36.34,30.91 36.34,30.69 v36.6,30.43
  Top 0.406: C13.2 44.1,30.44 U$3.P$3
  Top 0.508: v4.37,18.32 4.17,18.32 U3.2
  Bottom 0.508: v28.25,30.42 v23.52,30.42 v18.76,30.42 18.5,30.42 17.84,29.76 17.84,28.71 16.33,27.21 15.35,27.21 14,28.56 6.11,28.56 4.37,26.82 v4.37,18.32 | v46.97,30.45 v41.75,30.45 41.73,30.43 v36.6,30.43
N$4
  Top 0.203: U1.P$14 36,13.18 36.54,12.64 36.54,11.44 C1.1
N$5
  Top 0.203: C2.1 32.91,18.09 33.62,17.37 34.07,17.37 34.4,17.05 U1.P$6
N$6
  Top 0.254: U$2.P$1 49.37,29.34 R1.1
N$10
  Top 0.203: 35.42,18.61 34.44,19.58 R38.2 | 35.43,18.59 35.2,18.36 U1.P$4
  Top 0.254: R11.1 42.25,16.57 R10.1 41.49,17.32 37.53,17.32 36.25,18.59 35.43,18.59 35.42,18.61 | C16.2 R38.2
N$11
  Top 0.203: U2.3 29.18,25.05 28.88,25.35 28.42,25.35 R6.2
N$12
  Top 0.254: R7.2 36.46,21.55 36.46,23.06 R8.1 C10.1 32.78,23.7 31.72,23.7 31.11,24.31 U2.1
N$13
  Top 0.254: 39.26,19.77 | R7.1 37.21,19.79 39.23,19.79 39.26,19.77 | 39.26,19.77 40.15,18.88 C9.1 41.48,18.88 R10.2
N$14
  Top 0.254: R8.2 C10.2 33.36,23.26 30.69,23.26 29.74,22.3 U2.4 28.86,22.3 28.45,21.9 R9.2
N$16
  Top 0.203: R12.2 46.45,19.59 C11.1 46.19,19.82 44.33,19.82 D7.A
N$17
  Top 0.254: U$2.P$4 45.52,29.91 43.23,29.91 U$3.P$1
N$18
  Top 0.254: U$4.P$1 38.57,29.34 39.67,30.44 U$3.P$4
N$19
  Top 0.254: U$5.P$1 29.84,30.02 29.84,31.28 30.09,31.54 35.09,31.54 35.69,30.94 U$4.P$4
N$23
  Top 0.203: U6.P$11 52.34,14.05 51.36,15.03 RX.P$1
N$24
  Top 0.254: U$6.P$1 25.29,29.34 26.4,30.45 27.32,30.45 U$5.P$4
N$25
  Top 0.254: U$7.P$1 20.59,29.34 21.69,30.44 U$6.P$4
N$28
  Top 0.203: U6.P$10 52.52,14.45 51.93,15.03 51.93,16.27 TX.P$1
N$30
  Top 0.254: U4.3 45.47,12.82 R16.1 C23.1
N$31
  Top 0.203: 56.94,14.45 57.65,14.45 58.93,15.73 58.93,16.89 59.64,17.6 J2.P$1 | U6.P$26 56.94,14.45 | 56.94,14.45
N$34
  Top 0.254: R11.2 43.38,16.18 D7.C
N$35
  Top 0.203: J2.P$4 59.92,14.05 U6.P$25
N$36
  Top 0.203: U6.P$24 59.05,13.64 J2.P$5
N$49
  Top 0.203: U1.P$2 36,17.05 36.28,17.33 36.92,17.33 C40.1
SWITCH
  Top 0.2: U6.P$21 59.46,12.15 59.87,11.74 61.12,11.74
  Top 0.203: 61.12,11.74 U$12.P$1
THERMISTOR
  Top 0.203: U6.P$12 52.16,13.65 50.05,15.75 R27.1 49.08,15.75 48.27,16.55 48.19,16.47 C25.1 46.47,15.12 R28.2
THERMISTOR_ENABLE
  Top 0.203: U6.P$13 52.55,13.25 52.53,13.23 52.02,13.23 51.04,14.21 R27.2
WS_DATA  (via drill 0.35)
  Top 0.19: v57.4,11.47 55.54,11.47 55.3,11.71 U6.P$19
  Top 0.254: v52.41,29.55 51.26,29.55 R1.2
  Bottom 0.254: v52.41,29.55 53.19,28.77 61.47,28.77 61.84,28.4 62.26,28.4 63.96,26.7 63.96,25.25 64.39,24.83 64.39,13.8 64.16,13.57 64.16,10.63 63.66,10.13 57.75,10.13 57.35,10.53 57.35,11.42 v57.4,11.47

### Text on the board
tNames: R | GND- | T | ^ | ^ | GND | J1 | U1 | V+ | SW | eEVO v1.7 20241001